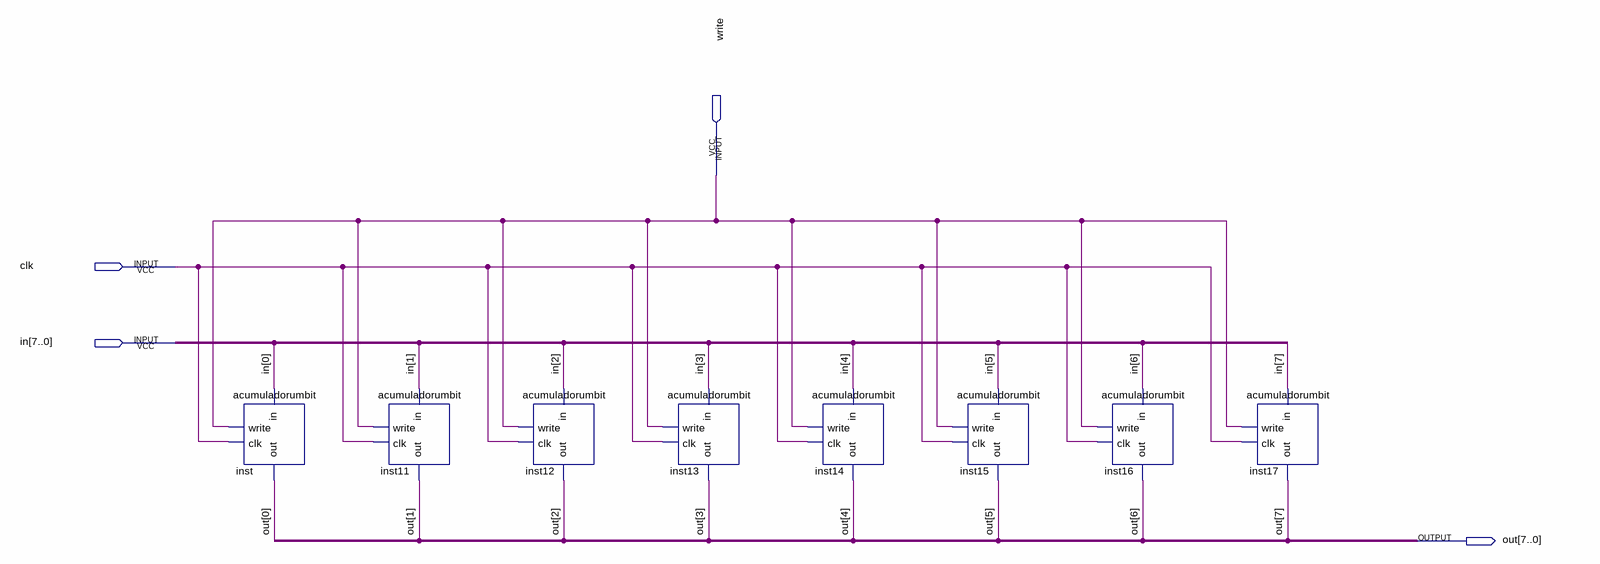
[diagram p0: schematic sheet]
// Quartus schematic registradoroitobit.bdf as structural Verilog: 8 symbols, 4 pins
module registradoroitobit (
  input  write,
  input  clk,
  input  [7:0] in,
  output [7:0] out
);

  acumuladorumbit inst (.in(in[0]), .write(write), .clk(clk), .out(out[0]));
  acumuladorumbit inst11 (.in(in[1]), .write(write), .clk(clk), .out(out[1]));
  acumuladorumbit inst12 (.in(in[2]), .write(write), .clk(clk), .out(out[2]));
  acumuladorumbit inst13 (.in(in[3]), .write(write), .clk(clk), .out(out[3]));
  acumuladorumbit inst14 (.in(in[4]), .write(write), .clk(clk), .out(out[4]));
  acumuladorumbit inst15 (.in(in[5]), .write(write), .clk(clk), .out(out[5]));
  acumuladorumbit inst16 (.in(in[6]), .write(write), .clk(clk), .out(out[6]));
  acumuladorumbit inst17 (.in(in[7]), .write(write), .clk(clk), .out(out[7]));
endmodule
